# EAGLE schematic delayed_pulser (EAGLE 6.5.0)
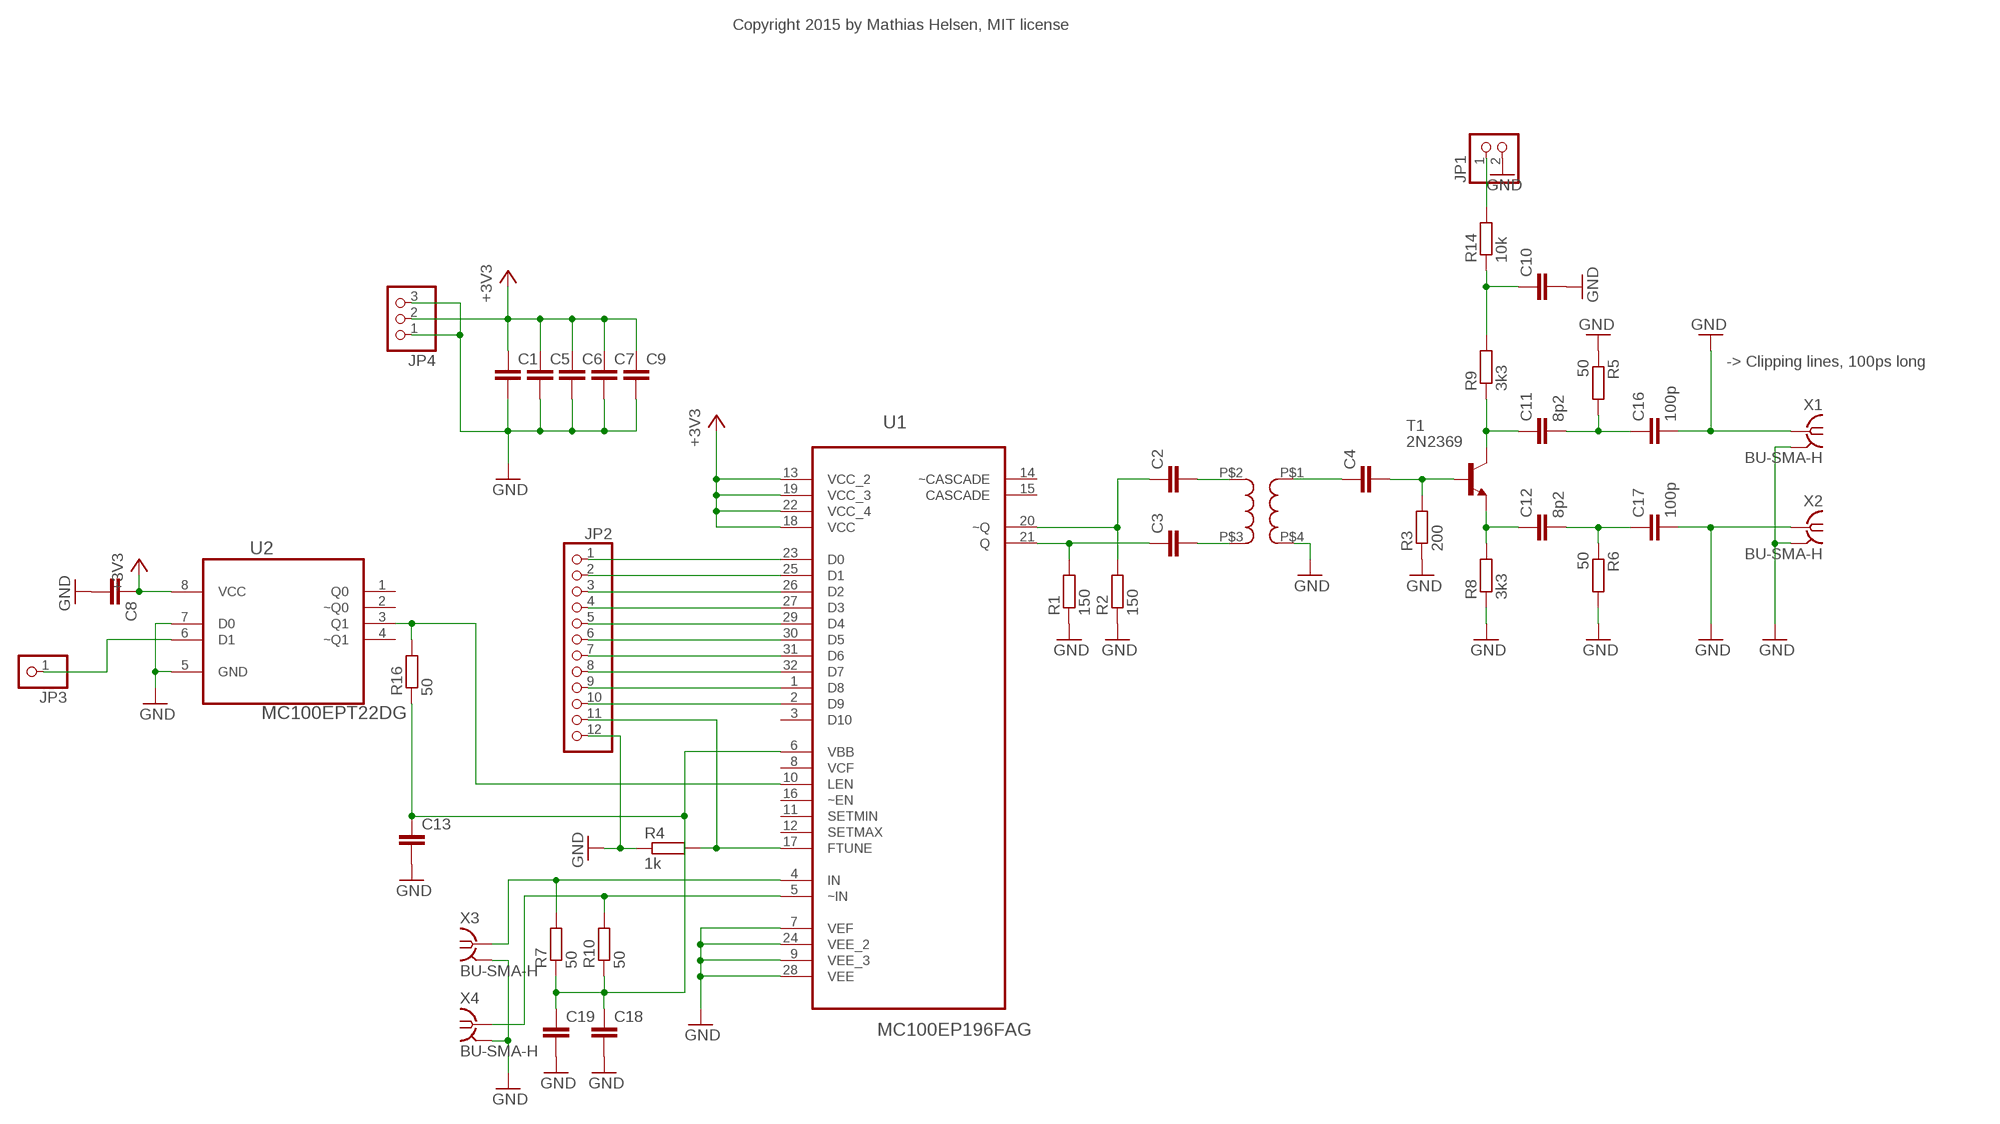
[diagram p0: schematic, sheet 1]

## Parts
C1  C-EUC0805  [C0805]
C2  C-EUC0805  [C0805]
C3  C-EUC0805  [C0805]
C4  C-EUC0805  [C0805]
C5  C-EUC0805  [C0805]
C6  C-EUC0805  [C0805]
C7  C-EUC0805  [C0805]
C8  C-EUC0805  [C0805]
C9  C-EUC1206  [C1206]
C10  C-EUC0805  [C0805]
C11  8p2  C-EUC0603  [C0603]
C12  8p2  C-EUC0603  [C0603]
C13  C-EUC0805  [C0805]
C16  100p  C-EUC0603  [C0603]
C17  100p  C-EUC0603  [C0603]
C18  C-EUC0805  [C0805]
C19  C-EUC0805  [C0805]
JP1  PINHD-1X2  [1X02]
JP2  PINHD-1X12  [1X12]
JP3  PINHD-1X1  [1X01]
JP4  PINHD-1X3  [1X03]
R1  150  R-EU_R0805  [R0805]
R2  150  R-EU_R0805  [R0805]
R3  200  R-EU_R0805  [R0805]
R4  1k  R-EU_R0805  [R0805]
R5  50  R-EU_R0603  [R0603]
R6  50  R-EU_R0603  [R0603]
R7  50  R-EU_R0805  [R0805]
R8  3k3  R-EU_R0805  [R0805]
R9  3k3  R-EU_R0805  [R0805]
R10  50  R-EU_R0805  [R0805]
R14  10k  R-EU_R0805  [R0805]
R16  50  R-EU_R0805  [R0805]
T1  2N2369  [TO18]
U1  MC100EP196FAG  [QFP80P900X900X160-32N]
U2  MC100EPT22DG  [SOIC127P600X175-8N]
U$1  JA4220  [T]
X1  BU-SMA-H  [BU-SMA-H]
X2  BU-SMA-H  [BU-SMA-H]
X3  BU-SMA-H  [BU-SMA-H]
X4  BU-SMA-H  [BU-SMA-H]

## Nets
+3V3: C1.1 C5.1 C6.1 C7.1 C8.1 C9.1 JP4.2 U1.13(VCC_2) U1.18(VCC) U1.19(VCC_3) U1.22(VCC_4) U2.8(VCC)
GND: C1.2 C5.2 C6.2 C7.2 C8.2 C9.2 C10.2 C13.2 C16.2 C17.2 C18.2 C19.2 JP1.2 JP2.12 JP4.1 JP4.3 R1.1 R2.1 R3.1 R4.1 R5.1 R6.2 R8.1 U1.7(VEF) U1.9(VEE_3) U1.24(VEE_2) U1.28(VEE) U2.5(GND) U2.7(D0) U$1.P$4 X1.1 X1.2 X1.3 X1.4 X1.5 X2.1 X2.2 X2.3 X2.4 X2.5 X3.2 X3.3 X3.4 X3.5 X4.2 X4.3 X4.4 X4.5
N$1: JP2.1 U1.23(D0)
N$2: C3.1 R1.2 U1.21(Q)
N$3: C2.1 R2.2 U1.20(~Q)
N$4: C2.2 U$1.P$2
N$5: C3.2 U$1.P$3
N$6: C4.1 U$1.P$1
N$7: C4.2 R3.2 T1.2(B)
N$8: JP2.2 U1.25(D1)
N$9: JP2.11 R4.2 U1.17(FTUNE)
N$10: JP2.3 U1.26(D2)
N$11: C11.1 R9.1 T1.3(C)
N$12: C12.1 R8.2 T1.1(E)
N$14: JP2.4 U1.27(D3)
N$15: JP2.5 U1.29(D4)
N$16: JP2.6 U1.30(D5)
N$17: JP2.7 U1.31(D6)
N$18: JP2.8 U1.32(D7)
N$19: C10.1 R9.2 R14.1
N$20: JP2.9 U1.1(D8)
N$21: JP2.10 U1.2(D9)
N$22: JP1.1 R14.2
N$26: C11.2 C16.1 R5.2
N$27: C12.2 C17.1 R6.1
N$30: R10.2 U1.5(~IN) X4.1
N$31: R7.2 U1.4(IN) X3.1
N$32: R16.2 U1.10(LEN) U2.3(Q1)
N$34: JP3.1 U2.6(D1)
VBB: C13.1 C18.1 C19.1 R7.1 R10.1 R16.1 U1.6(VBB)
Unconnected: U1.3(D10) U1.8(VCF) U1.11(SETMIN) U1.12(SETMAX) U1.14(~CASCADE) U1.15(CASCADE) U1.16(~EN) U2.1(Q0) U2.2(~Q0) U2.4(~Q1)

## Notes on the sheet
- Copyright 2015 by Mathias Helsen, MIT license
- -> Clipping lines, 100ps long

## Library data of the parts
C1-C13 C16-C19 = resistor:C-EU: CAPACITOR, European symbol
JP1 = pinhead:PINHD-1X2: PIN HEADER
JP2 = pinhead:PINHD-1X12: PIN HEADER
JP3 = pinhead:PINHD-1X1: PIN HEADER
JP4 = pinhead:PINHD-1X3: PIN HEADER
R1-R10 R14 R16 = resistor:R-EU_: RESISTOR, European symbol
T1 = transistor-neu-to92:2N2369: NPN TRANSISTOR
U1 = MC100EP196:MC100EP196FAG: 3.3V ECL Programmable Delay Chip; MPN: MC100EP196FAG; OC_FARNELL: 1703312; OC_NEWARK: 88H4711; PACKAGE: LQFP-32; SUPPLIER: ON SEMICONDUCTOR
U2 = MC100EPT22:MC100EPT22DG: 3.3VDual LVTTL/LVCMOS to Differential LVPECL Translator; MPN: MC100EPT22DG; OC_FARNELL: 1607867; OC_NEWARK: 45J0924; PACKAGE: SOIC-8; SUPPLIER: Onsemiconductor
U$1 = \cct:JA4220
X1-X4 = con-coax:BU-SMA-H: FEMALE SMA CONNECTOR Radiall; OC_FARNELL: unknown; OC_NEWARK: unknown